# Altium schematic sheet BLACKPEARLROBOT.SchDoc
size A3
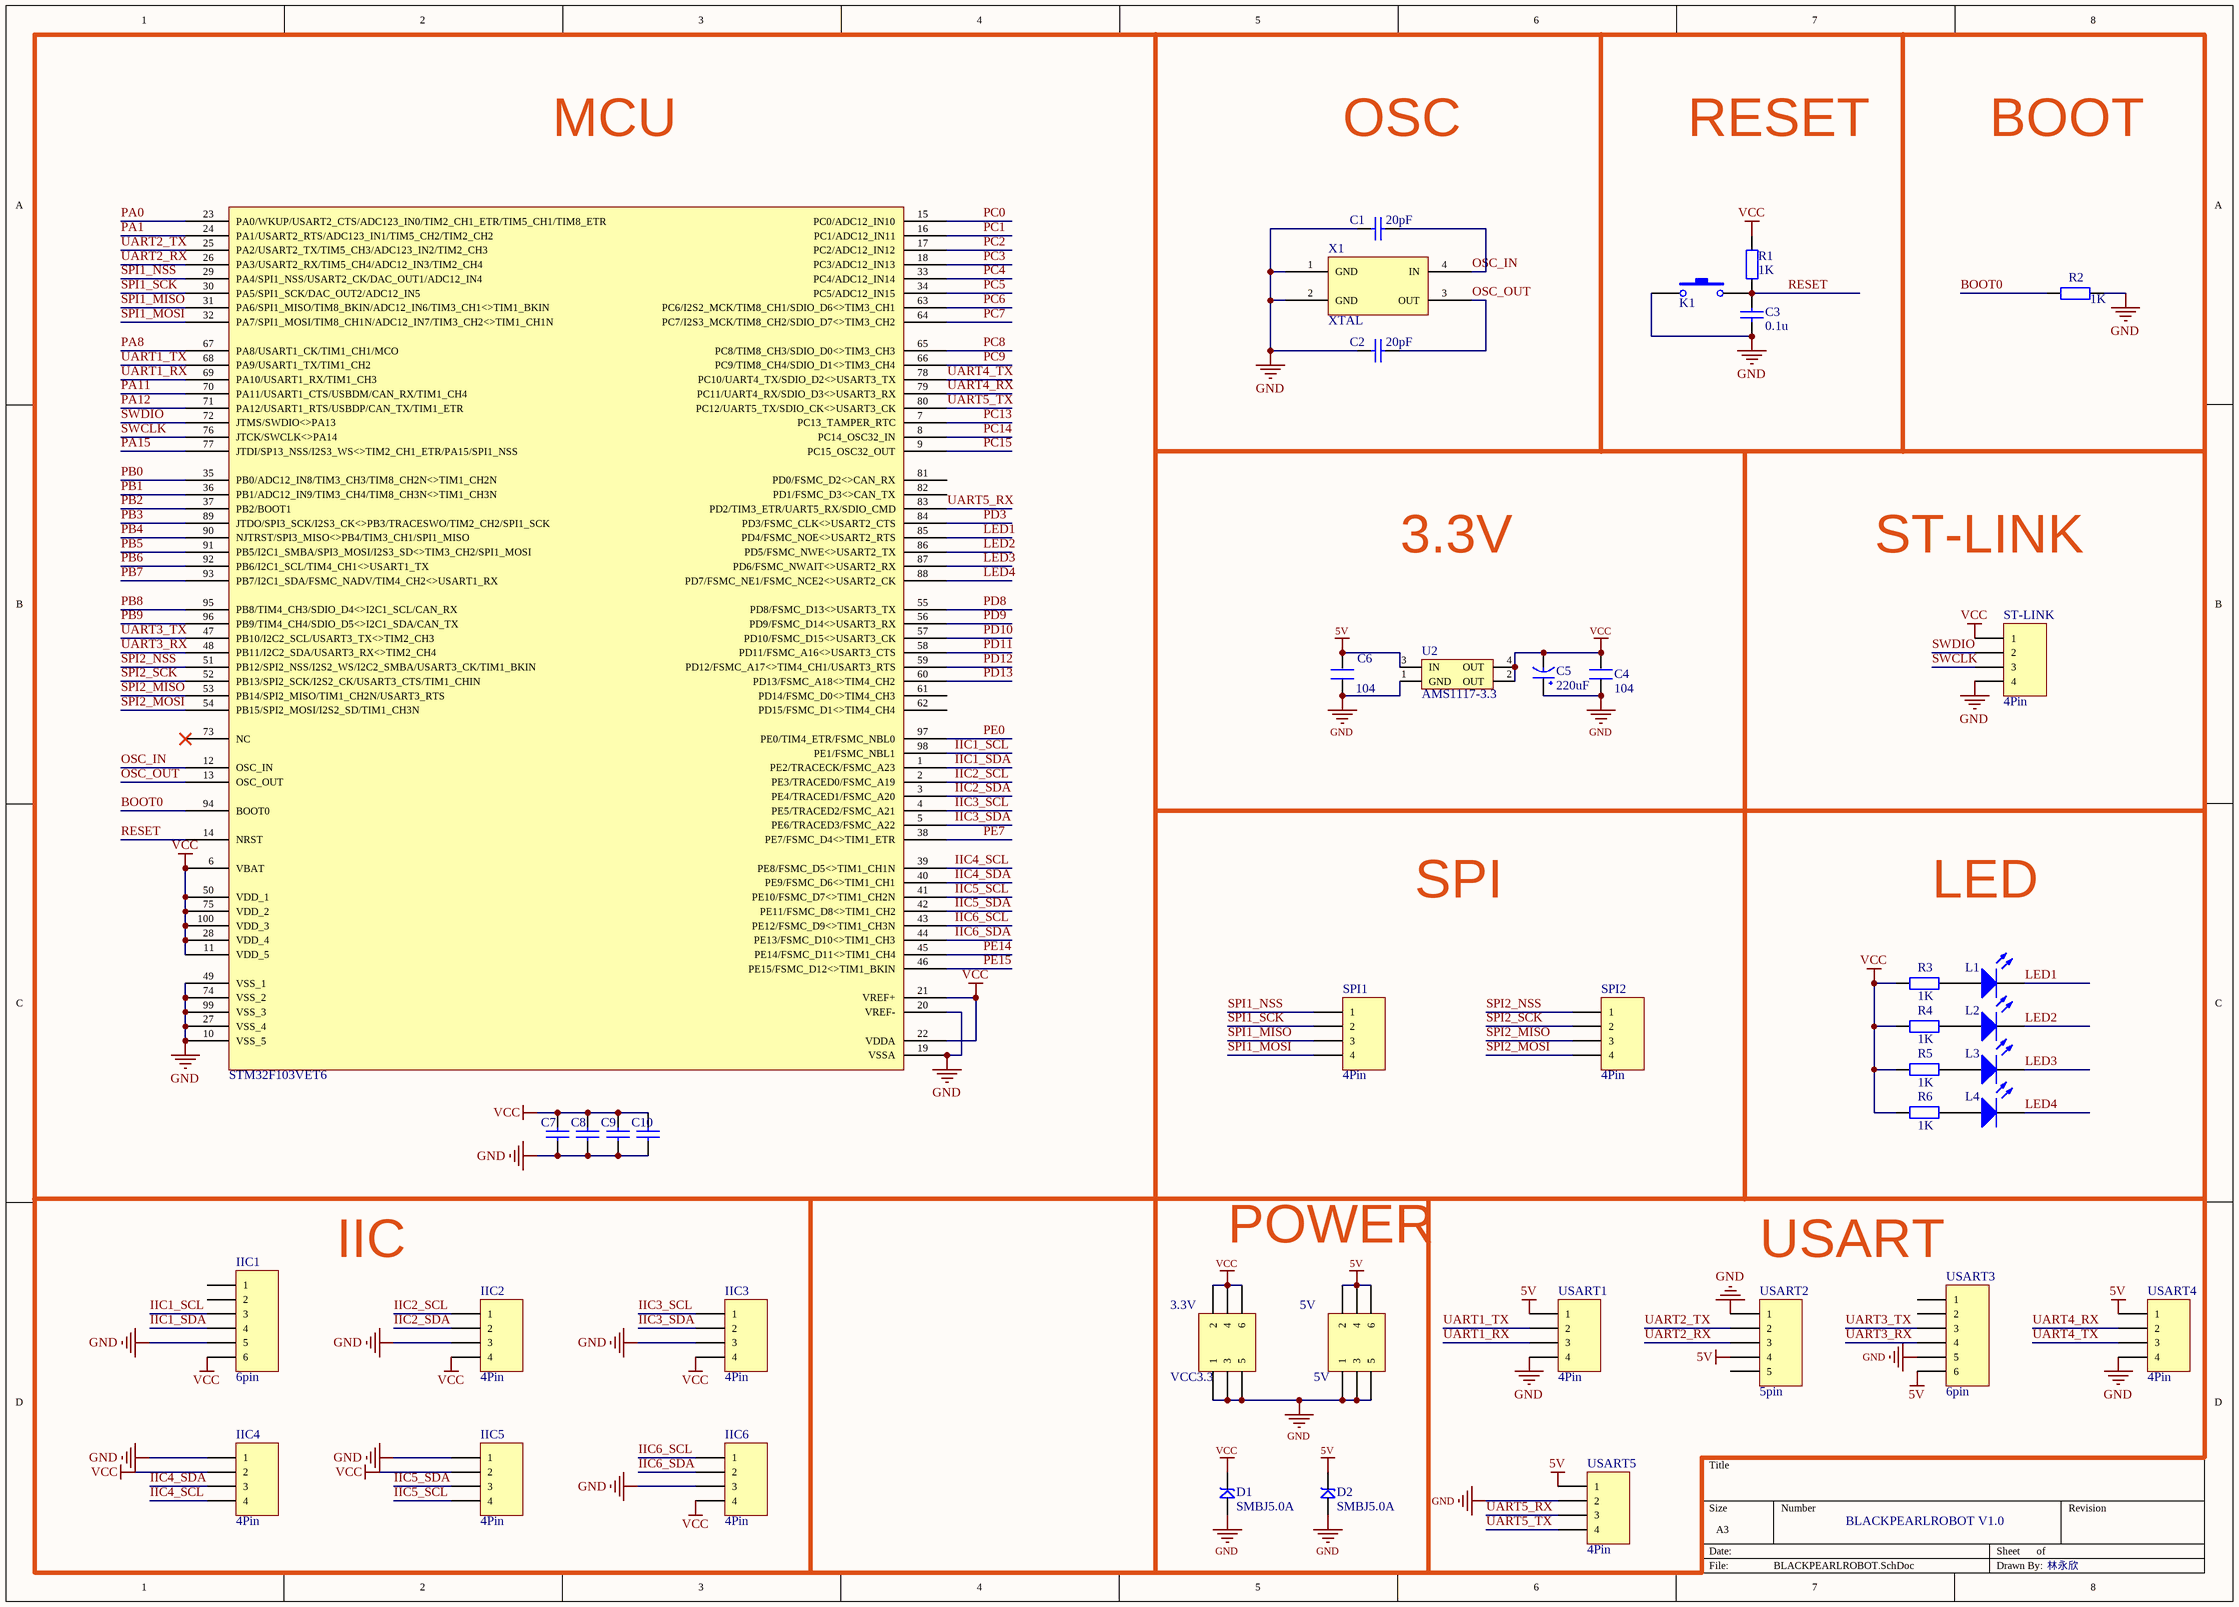
[diagram p0: BLACKPEARLROBOT.SchDoc]

## Parts
3.3V  VCC3.3  [HDR2X3]
5V  5V  [HDR2X3]
C1  20pF  [Cap-0603]
C2  20pF  [Cap-0603]
C3  0.1u  [Cap-0603]
C4  104  [0603P]
C5  220uF  [CC6.56.5]
C6  104  [0603P]
C7  0.1u  [Cap-0603]  (value not drawn)
C8  0.1u  [Cap-0603]  (value not drawn)
C9  0.1u  [Cap-0603]  (value not drawn)
C10  0.1u  [Cap-0603]  (value not drawn)
D1  SMBJ5.0A  [SMBJ]
D2  SMBJ5.0A  [SMBJ]
IIC1  6pin  [HDR1X6]
IIC2  4Pin  [4Pin]
IIC3  4Pin  [4Pin]
IIC4  4Pin  [4Pin]
IIC5  4Pin  [4Pin]
IIC6  4Pin  [4Pin]
K1  KEY  [KEY-tie]  (value not drawn)
L1  LED-0805  [LED-0805]  (value not drawn)
L2  LED-0805  [LED-0805]  (value not drawn)
L3  LED-0805  [LED-0805]  (value not drawn)
L4  LED-0805  [LED-0805]  (value not drawn)
R1  1K  [RES-0603]
R2  1K  [RES-0603]
R3  1K  [RES-0603]
R4  1K  [RES-0603]
R5  1K  [RES-0603]
R6  1K  [RES-0603]
SPI1  4Pin  [4Pin]
SPI2  4Pin  [4Pin]
ST-LINK  4Pin  [4Pin]
U1  STM32F103VET6  [STM32F103VET6]
U2  AMS1117-3.3  [AMS1117]
USART1  4Pin  [4Pin]
USART2  5pin  [HDR1X5]
USART3  6pin  [HDR1X6]
USART4  4Pin  [4Pin]
USART5  4Pin  [4Pin]
X1  XTAL  [XTAL-tie]

## Nets
5V: 5V.2 5V.4 5V.6 C6.2 D2.2 U2.3(IN) USART1.1 USART2.4 USART3.6 USART4.1 USART5.1
GND: 3.3V.1 3.3V.3 3.3V.5 5V.1 5V.3 5V.5 C1.1 C2.1 C3.1 C4.2 C5.1(VCC) C6.1 C7.1 C8.1 C9.1 C10.1 D1.1 D2.1 IIC1.5 IIC2.3 IIC3.3 IIC4.1 IIC5.1 IIC6.3 K1.2 R2.2 ST-LINK.4 U1.10(VSS_5) U1.19(VSSA) U1.20(VREF-) U1.27(VSS_4) U1.49(VSS_1) U1.74(VSS_2) U1.99(VSS_3) U2.1(GND) USART1.4 USART2.1 USART3.5 USART4.4 USART5.2 X1.1(GND) X1.2(GND)
VCC: 3.3V.2 3.3V.4 3.3V.6 C4.1 C5.2(GND) C7.2 C8.2 C9.2 C10.2 D1.2 IIC1.6 IIC2.4 IIC3.4 IIC4.2 IIC5.2 IIC6.4 R1.2 R3.1 R4.1 R5.1 R6.1 ST-LINK.1 U1.6(VBAT) U1.11(VDD_5) U1.21(VREF+) U1.22(VDDA) U1.28(VDD_4) U1.50(VDD_1) U1.75(VDD_2) U1.100(VDD_3) U2.2(OUT) U2.4(OUT)
BOOT0: R2.1 U1.94(BOOT0)
IIC1_SCL: IIC1.3 U1.98(PE1/FSMC_NBL1)
IIC1_SDA: IIC1.4 U1.1(PE2/TRACECK/FSMC_A23)
IIC2_SCL: IIC2.1 U1.2(PE3/TRACED0/FSMC_A19)
IIC2_SDA: IIC2.2 U1.3(PE4/TRACED1/FSMC_A20)
IIC3_SCL: IIC3.1 U1.4(PE5/TRACED2/FSMC_A21)
IIC3_SDA: IIC3.2 U1.5(PE6/TRACED3/FSMC_A22)
IIC4_SCL: IIC4.4 U1.39(PE8/FSMC_D5<>TIM1_CH1N)
IIC4_SDA: IIC4.3 U1.40(PE9/FSMC_D6<>TIM1_CH1)
IIC5_SCL: IIC5.4 U1.41(PE10/FSMC_D7<>TIM1_CH2N)
IIC5_SDA: IIC5.3 U1.42(PE11/FSMC_D8<>TIM1_CH2)
IIC6_SCL: IIC6.1 U1.43(PE12/FSMC_D9<>TIM1_CH3N)
IIC6_SDA: IIC6.2 U1.44(PE13/FSMC_D10<>TIM1_CH3)
LED1: L1.2(K) U1.85(PD4/FSMC_NOE<>USART2_RTS)
LED2: L2.2(K) U1.86(PD5/FSMC_NWE<>USART2_TX)
LED3: L3.2(K) U1.87(PD6/FSMC_NWAIT<>USART2_RX)
LED4: L4.2(K) U1.88(PD7/FSMC_NE1/FSMC_NCE2<>USART2_CK)
OSC_IN: C1.2 U1.12(OSC_IN) X1.4(IN)
OSC_OUT: C2.2 U1.13(OSC_OUT) X1.3(OUT)
PA0: U1.23(PA0/WKUP/USART2_CTS/ADC123_IN0/TIM2_CH1_ETR/TIM5_CH1/TIM8_ETR)
PA1: U1.24(PA1/USART2_RTS/ADC123_IN1/TIM5_CH2/TIM2_CH2)
PA8: U1.67(PA8/USART1_CK/TIM1_CH1/MCO)
PA11: U1.70(PA11/USART1_CTS/USBDM/CAN_RX/TIM1_CH4)
PA12: U1.71(PA12/USART1_RTS/USBDP/CAN_TX/TIM1_ETR)
PA15: U1.77(JTDI/SP13_NSS/I2S3_WS<>TIM2_CH1_ETR/PA15/SPI1_NSS)
PB0: U1.35(PB0/ADC12_IN8/TIM3_CH3/TIM8_CH2N<>TIM1_CH2N)
PB1: U1.36(PB1/ADC12_IN9/TIM3_CH4/TIM8_CH3N<>TIM1_CH3N)
PB2: U1.37(PB2/BOOT1)
PB3: U1.89(JTDO/SPI3_SCK/I2S3_CK<>PB3/TRACESWO/TIM2_CH2/SPI1_SCK)
PB4: U1.90(NJTRST/SPI3_MISO<>PB4/TIM3_CH1/SPI1_MISO)
PB5: U1.91(PB5/I2C1_SMBA/SPI3_MOSI/I2S3_SD<>TIM3_CH2/SPI1_MOSI)
PB6: U1.92(PB6/I2C1_SCL/TIM4_CH1<>USART1_TX)
PB7: U1.93(PB7/I2C1_SDA/FSMC_NADV/TIM4_CH2<>USART1_RX)
PB8: U1.95(PB8/TIM4_CH3/SDIO_D4<>I2C1_SCL/CAN_RX)
PB9: U1.96(PB9/TIM4_CH4/SDIO_D5<>I2C1_SDA/CAN_TX)
PC0: U1.15(PC0/ADC12_IN10)
PC1: U1.16(PC1/ADC12_IN11)
PC2: U1.17(PC2/ADC12_IN12)
PC3: U1.18(PC3/ADC12_IN13)
PC4: U1.33(PC4/ADC12_IN14)
PC5: U1.34(PC5/ADC12_IN15)
PC6: U1.63(PC6/I2S2_MCK/TIM8_CH1/SDIO_D6<>TIM3_CH1)
PC7: U1.64(PC7/I2S3_MCK/TIM8_CH2/SDIO_D7<>TIM3_CH2)
PC8: U1.65(PC8/TIM8_CH3/SDIO_D0<>TIM3_CH3)
PC9: U1.66(PC9/TIM8_CH4/SDIO_D1<>TIM3_CH4)
PC13: U1.7(PC13_TAMPER_RTC)
PC14: U1.8(PC14_OSC32_IN)
PC15: U1.9(PC15_OSC32_OUT)
PD3: U1.84(PD3/FSMC_CLK<>USART2_CTS)
PD8: U1.55(PD8/FSMC_D13<>USART3_TX)
PD9: U1.56(PD9/FSMC_D14<>USART3_RX)
PD10: U1.57(PD10/FSMC_D15<>USART3_CK)
PD11: U1.58(PD11/FSMC_A16<>USART3_CTS)
PD12: U1.59(PD12/FSMC_A17<>TIM4_CH1/USART3_RTS)
PD13: U1.60(PD13/FSMC_A18<>TIM4_CH2)
PE0: U1.97(PE0/TIM4_ETR/FSMC_NBL0)
PE7: U1.38(PE7/FSMC_D4<>TIM1_ETR)
PE14: U1.45(PE14/FSMC_D11<>TIM1_CH4)
PE15: U1.46(PE15/FSMC_D12<>TIM1_BKIN)
RESET: C3.2 K1.1 R1.1 U1.14(NRST)
SPI1_MISO: SPI1.3 U1.31(PA6/SPI1_MISO/TIM8_BKIN/ADC12_IN6/TIM3_CH1<>TIM1_BKIN)
SPI1_MOSI: SPI1.4 U1.32(PA7/SPI1_MOSI/TIM8_CH1N/ADC12_IN7/TIM3_CH2<>TIM1_CH1N)
SPI1_NSS: SPI1.1 U1.29(PA4/SPI1_NSS/USART2_CK/DAC_OUT1/ADC12_IN4)
SPI1_SCK: SPI1.2 U1.30(PA5/SPI1_SCK/DAC_OUT2/ADC12_IN5)
SPI2_MISO: SPI2.3 U1.53(PB14/SPI2_MISO/TIM1_CH2N/USART3_RTS)
SPI2_MOSI: SPI2.4 U1.54(PB15/SPI2_MOSI/I2S2_SD/TIM1_CH3N)
SPI2_NSS: SPI2.1 U1.51(PB12/SPI2_NSS/I2S2_WS/I2C2_SMBA/USART3_CK/TIM1_BKIN)
SPI2_SCK: SPI2.2 U1.52(PB13/SPI2_SCK/I2S2_CK/USART3_CTS/TIM1_CHIN)
SWCLK: ST-LINK.3 U1.76(JTCK/SWCLK<>PA14)
SWDIO: ST-LINK.2 U1.72(JTMS/SWDIO<>PA13)
UART1_RX: U1.69(PA10/USART1_RX/TIM1_CH3) USART1.3
UART1_TX: U1.68(PA9/USART1_TX/TIM1_CH2) USART1.2
UART2_RX: U1.26(PA3/USART2_RX/TIM5_CH4/ADC12_IN3/TIM2_CH4) USART2.3
UART2_TX: U1.25(PA2/USART2_TX/TIM5_CH3/ADC123_IN2/TIM2_CH3) USART2.2
UART3_RX: U1.48(PB11/I2C2_SDA/USART3_RX<>TIM2_CH4) USART3.4
UART3_TX: U1.47(PB10/I2C2_SCL/USART3_TX<>TIM2_CH3) USART3.3
UART4_RX: U1.79(PC11/UART4_RX/SDIO_D3<>USART3_RX) USART4.2
UART4_TX: U1.78(PC10/UART4_TX/SDIO_D2<>USART3_TX) USART4.3
UART5_RX: U1.83(PD2/TIM3_ETR/UART5_RX/SDIO_CMD) USART5.3
UART5_TX: U1.80(PC12/UART5_TX/SDIO_CK<>USART3_CK) USART5.4
NetL1_1: L1.1(A) R3.2
NetL2_1: L2.1(A) R4.2
NetL3_1: L3.1(A) R5.2
NetL4_1: L4.1(A) R6.2

Not connected (* = marked no-connect by the designer): IIC1 1 2; U1 61(PD14/FSMC_D0<>TIM4_CH3) 62(PD15/FSMC_D1<>TIM4_CH4) 73(NC)* 81(PD0/FSMC_D2<>CAN_RX) 82(PD1/FSMC_D3<>CAN_TX); USART2 5; USART3 1 2

## Notes on the sheet
- MCU
- OSC
- RESET
- BOOT
- 3.3V
- ST-LINK
- SPI
- LED
- IIC
- POWER
- USART
- BLACKPEARLROBOT V1.0
- 林永欣

## Library data of the parts
3.3V 5V = Header 3X2: Header, 3-Pin, Dual row; LatestRevisionDate: 17-Jul-2002; LatestRevisionNote: Re-released for DXP Platform.; Publisher: Altium Limited
C1-C3 C7-C10 = Cap-0603
C4 C6 = C
C5 = CAP
D1 D2 = SMBJ: TVS
IIC1 USART3 = Header 6: Header, 6-Pin; LatestRevisionDate: 17-Jul-2002; LatestRevisionNote: Re-released for DXP Platform.; Publisher: Altium Limited
K1 = KEY-tie
R1-R6 = RST-0603
U2 = AMS1117
USART2 = Header 5: Header, 5-Pin; LatestRevisionDate: 17-Jul-2002; LatestRevisionNote: Re-released for DXP Platform.; Publisher: Altium Limited
X1 = XTAL-tie